# EAGLE design 2nd_layer (EAGLE 9.6.2)
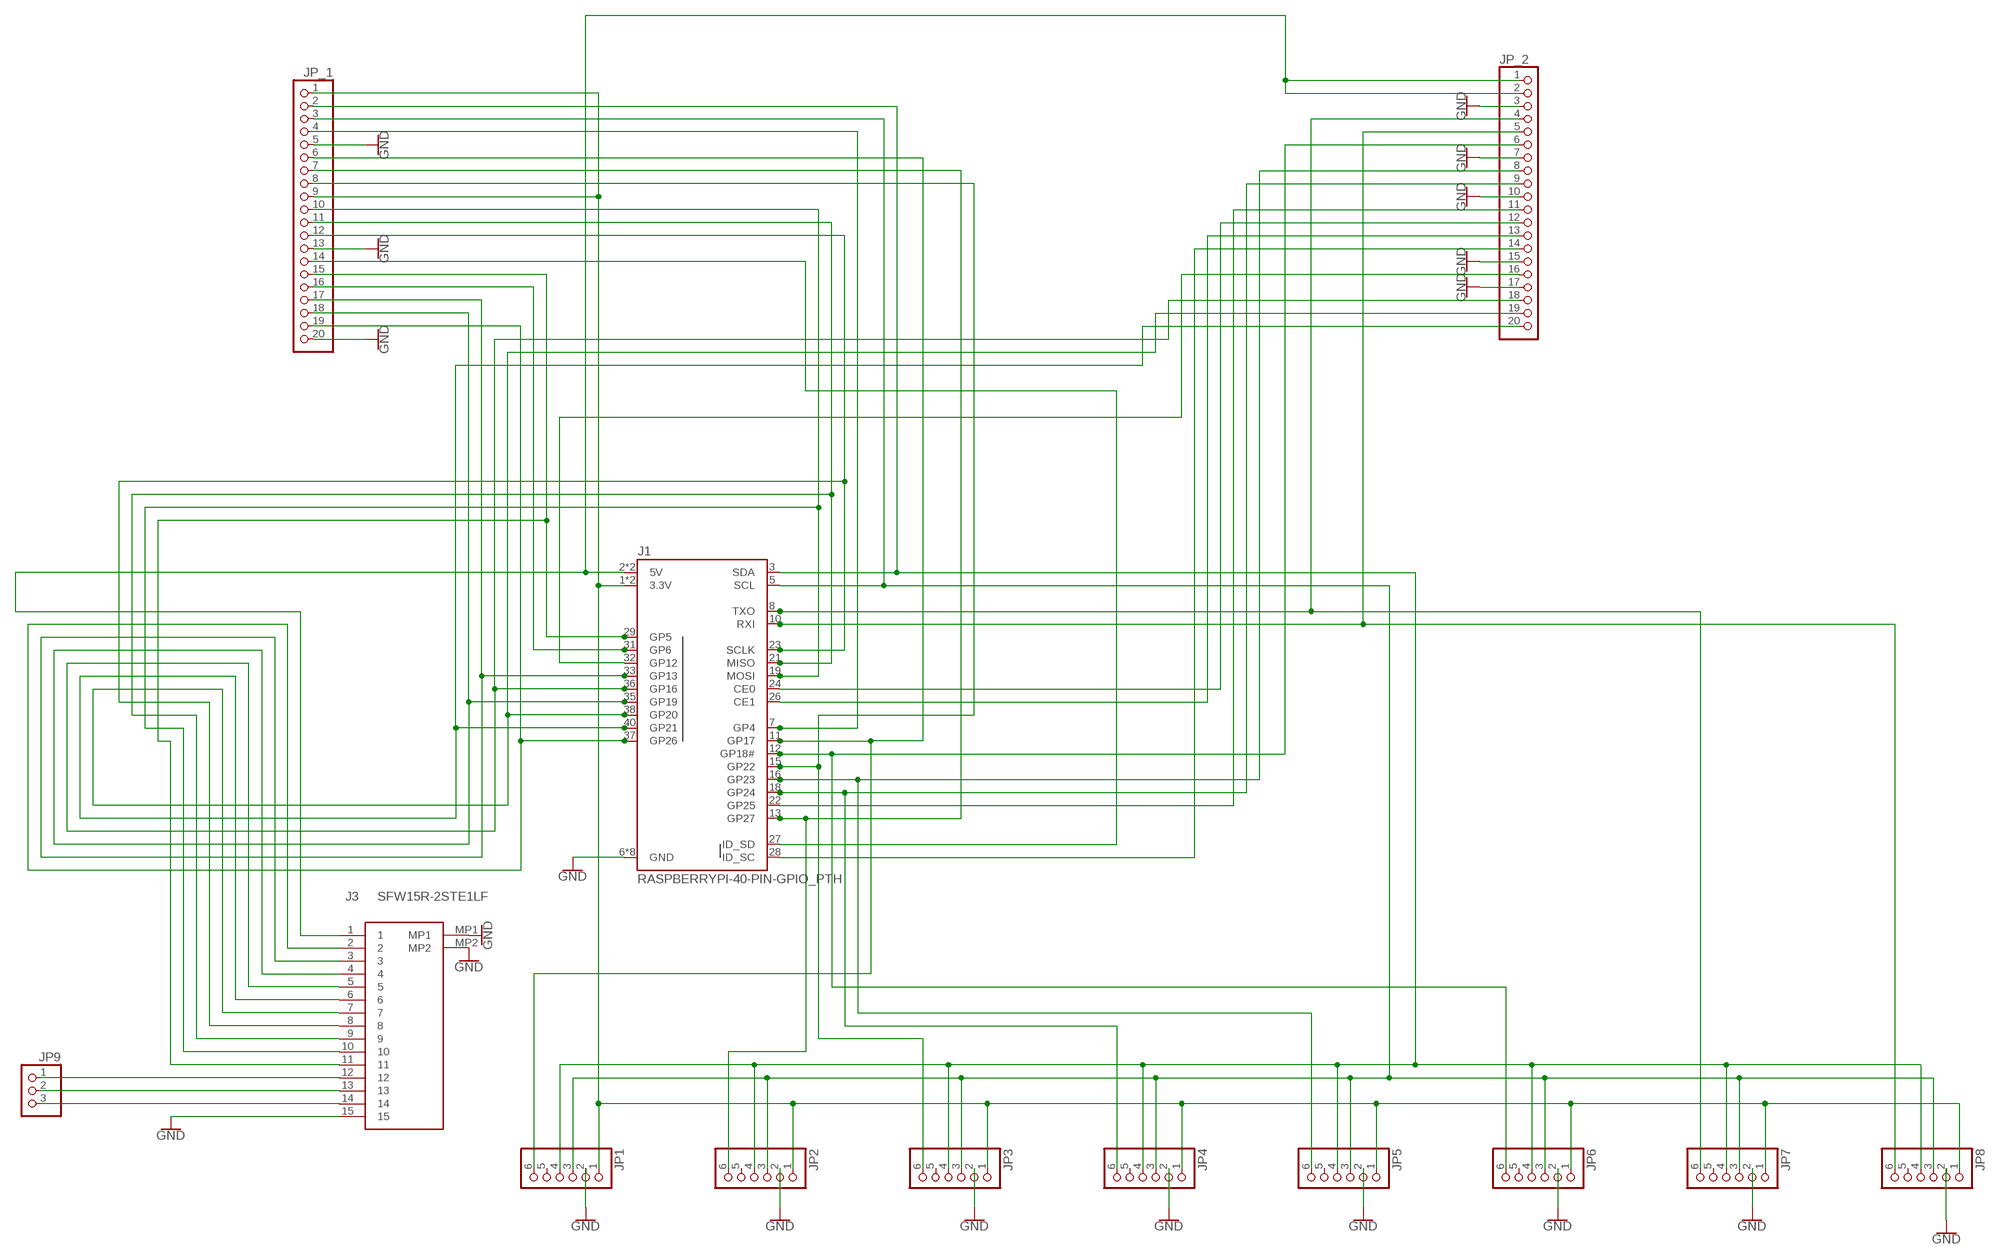
[diagram p0: schematic, sheet 1]

## Parts
J1  RASPBERRYPI-40-PIN-GPIO_PTH  [2X20_SHROUDED]
J3  SFW15R-2STE1LF  [SFW15R2STE1LF]
JP1  PINHD-1X6  [1X06]
JP2  PINHD-1X6  [1X06]
JP3  PINHD-1X6  [1X06]
JP4  PINHD-1X6  [1X06]
JP5  PINHD-1X6  [1X06]
JP6  PINHD-1X6  [1X06]
JP7  PINHD-1X6  [1X06]
JP8  PINHD-1X6  [1X06]
JP9  PINHD-1X3  [1X03]
JP_1  PINHD-1X20  [1X20]
JP_2  PINHD-1X20  [1X20]

## Nets
GND: J1.6(GND) J1.9(GND) J1.14(GND) J1.20(GND) J1.25(GND) J1.30(GND) J1.34(GND) J1.39(GND) J3.15 J3.MP1 J3.MP2 JP1.2 JP2.2 JP3.2 JP4.2 JP5.2 JP6.2 JP7.2 JP8.2 JP_1.5 JP_1.13 JP_1.20 JP_2.3 JP_2.7 JP_2.10 JP_2.15 JP_2.17
N$1: J1.7(GP4) JP_1.4
N$2: J1.31(GP6) JP_1.16
N$3: J1.22(GP25) JP_2.11
N$4: J1.2(5V) J1.4(5V) J3.1 JP_2.1 JP_2.2
N$5: J1.1(3.3V) J1.17(3.3V) JP1.1 JP2.1 JP3.1 JP4.1 JP5.1 JP6.1 JP7.1 JP8.1 JP_1.1 JP_1.9
N$6: J1.27(ID_SD) JP_1.14
N$7: J1.5(SCL) JP1.3 JP2.3 JP3.3 JP4.3 JP5.3 JP6.3 JP7.3 JP8.3 JP_1.3
N$8: J1.3(SDA) JP1.4 JP2.4 JP3.4 JP4.4 JP5.4 JP6.4 JP7.4 JP8.4 JP_1.2
N$9: J1.11(GP17) JP1.6 JP_1.6
N$10: J1.13(GP27) JP2.6 JP_1.7
N$11: J1.15(GP22) JP3.6 JP_1.8
N$12: J1.18(GP24) JP4.6 JP_2.9
N$13: J1.16(GP23) JP5.6 JP_2.8
N$14: J1.12(GP18#) JP6.6 JP_2.6
N$15: J1.8(TXO) JP7.6 JP_2.4
N$16: J1.10(RXI) JP8.6 JP_2.5
N$17: J1.37(GP26) J3.2 JP_1.19
N$18: J1.33(GP13) J3.3 JP_1.17
N$19: J1.35(GP19) J3.4 JP_1.18
N$20: J1.36(GP16) J3.5 JP_2.18
N$21: J1.40(GP21) J3.6 JP_2.20
N$22: J1.38(GP20) J3.7 JP_2.19
N$23: J1.23(SCLK) J3.8 JP_1.12
N$24: J1.21(MISO) J3.9 JP_1.11
N$25: J1.19(MOSI) J3.10 JP_1.10
N$26: J1.29(GP5) J3.11 JP_1.15
N$27: J1.24(CE0) JP_2.12
N$28: J1.26(CE1) JP_2.13
N$29: J1.28(ID_SC) JP_2.14
N$30: J1.32(GP12) JP_2.16
N$31: J3.12 JP9.1
N$32: J3.13 JP9.2
N$33: J3.14 JP9.3
Unconnected: JP1.5 JP2.5 JP3.5 JP4.5 JP5.5 JP6.5 JP7.5 JP8.5

## Library data of the parts
J1 = SparkFun-Connectors:RASPBERRYPI-40-PIN-GPIO: Raspberry Pi GPIO Header 2x20 pin connector, as found on B, B+, A+ models. Both shrouded PTH and SMT versions available. SparkFun Products: GPIO Shrouded Header <https://www.sparkfun.com/products/13054>- PTH SparkFun Pi Wedge (Preassembled) <https://www.sparkfun.com/products/13717>; PROD_ID: CONN-12263; SF_ID: PRT-13054
J3 = SFW15R-2STE1LF:SFW15R-2STE1LF: FFC & FPC Connectors 15P SIDE SMT ZIF UPPER CONTACT Source: Datasheet <https://cdn.amphenol-icc.com/media/wysiwyg/files/drawing/sfw12lf.pdf>; DESCRIPTION: FFC & FPC Connectors 15P SIDE SMT ZIF UPPER CONTACT; HEIGHT: 2.7mm; MANUFACTURER_NAME: Amphenol; MANUFACTURER_PART_NUMBER: SFW15R-2STE1LF
JP1-JP8 = adafruit:PINHD-1X6: PIN HEADER
JP9 = pinhead:PINHD-1X3: PIN HEADER
JP_1 JP_2 = pinhead:PINHD-1X20: PIN HEADER

## Board
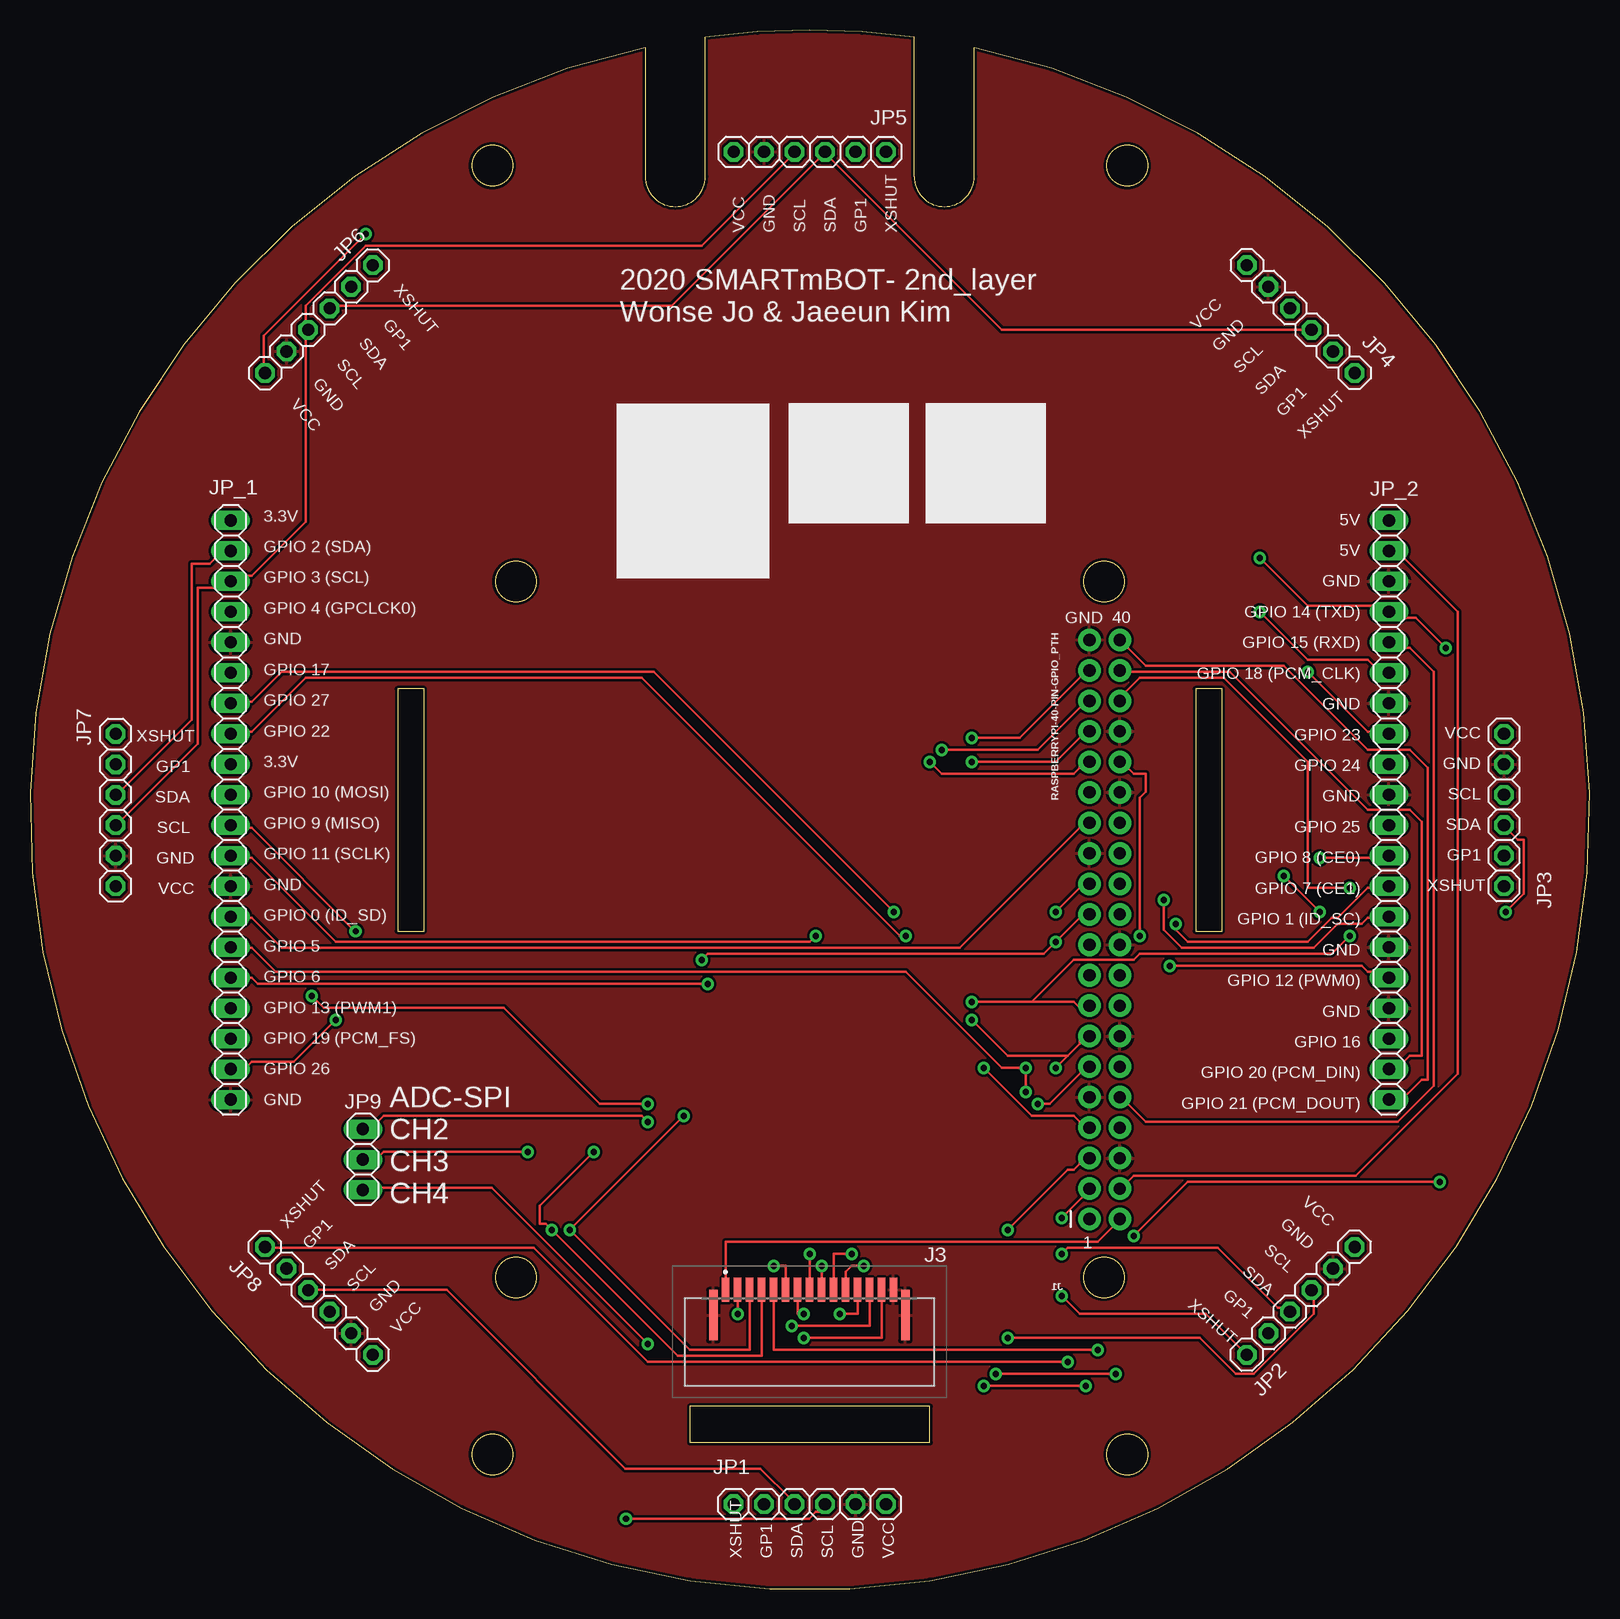
[diagram p1: board, top side]
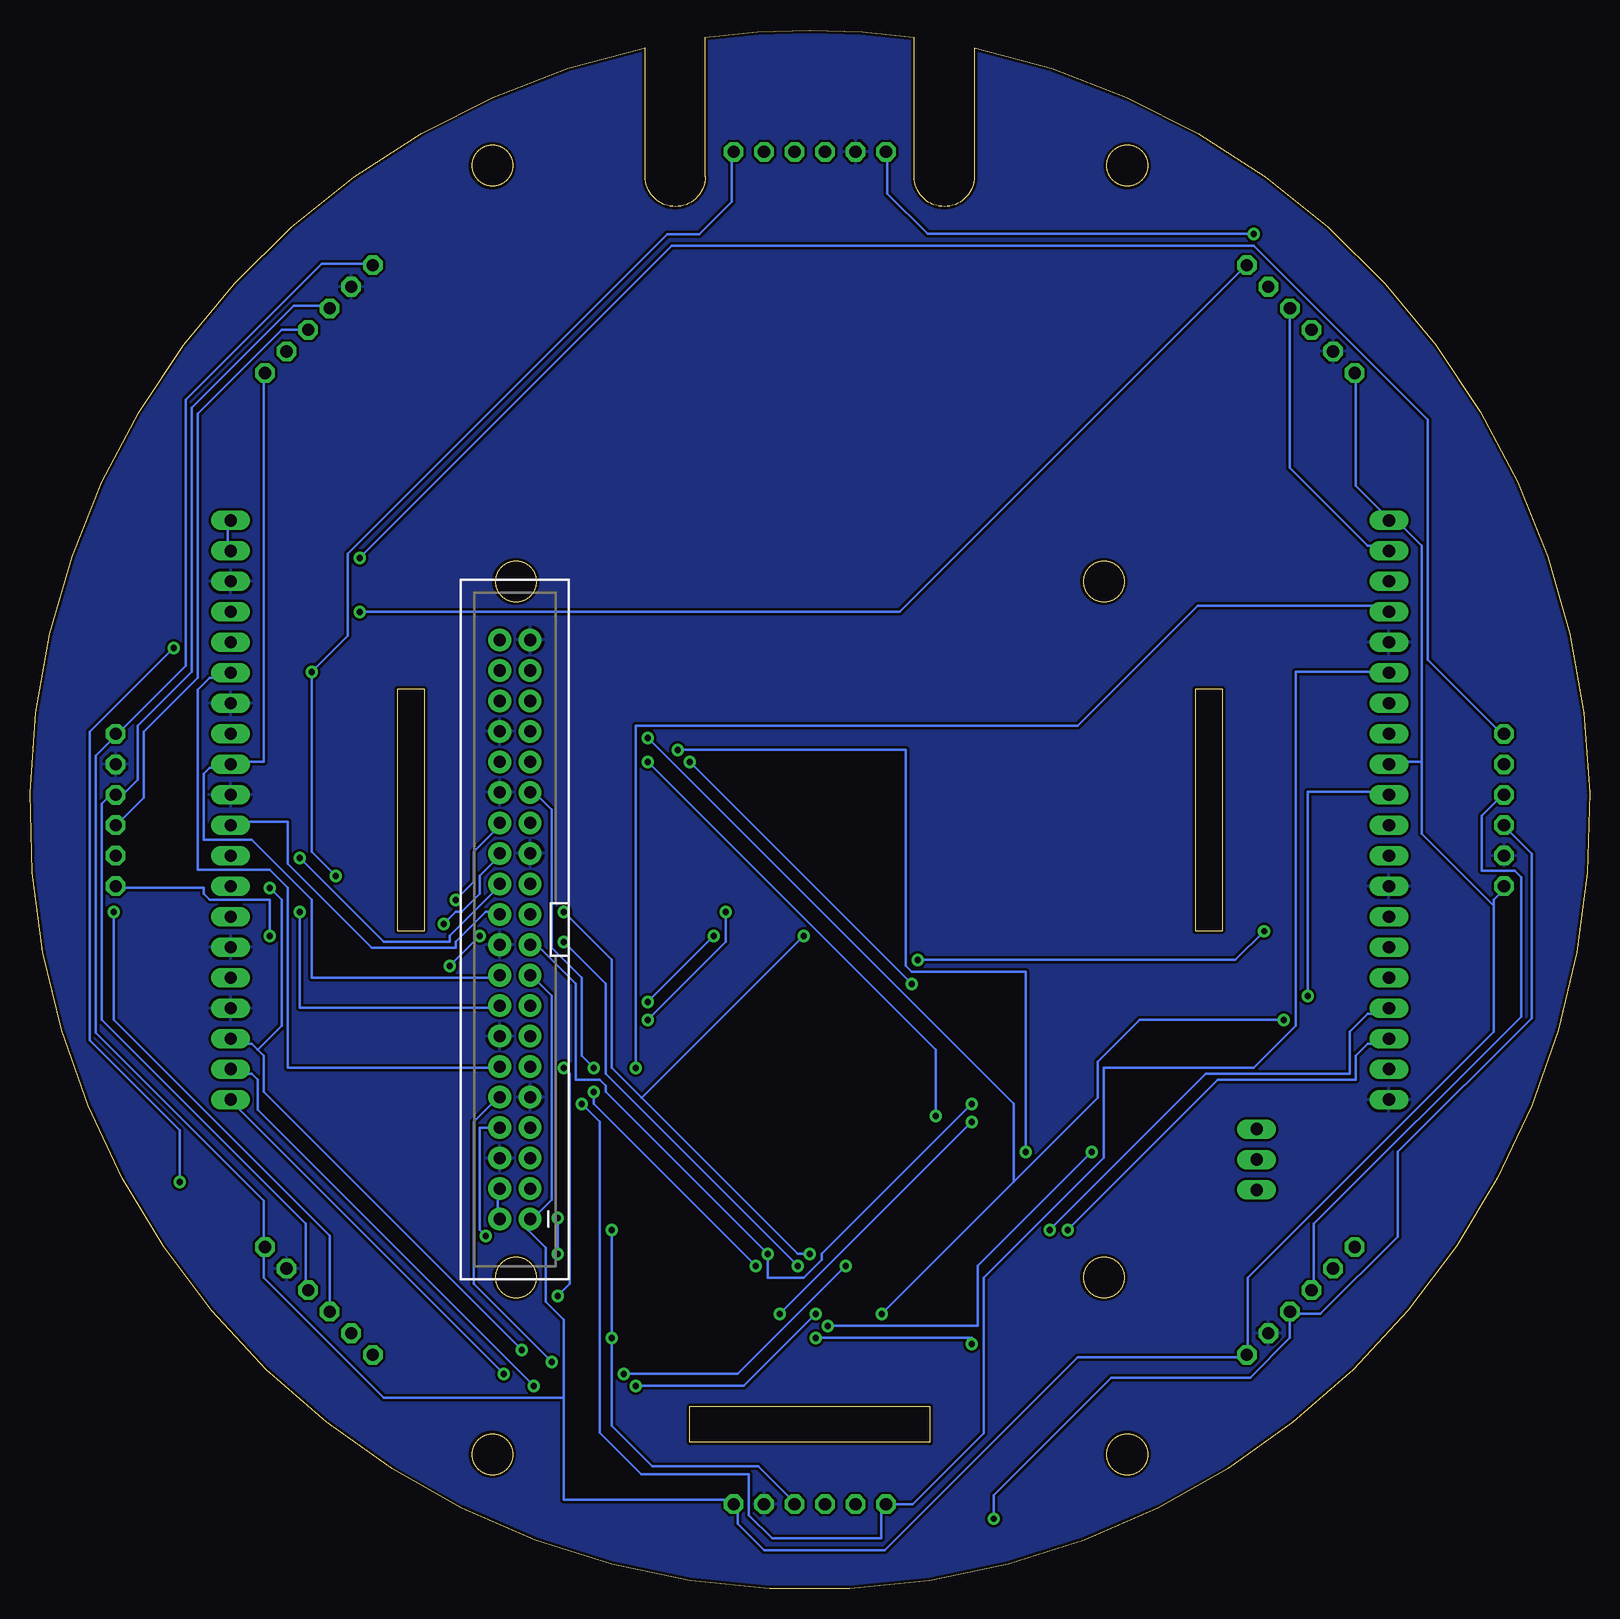
[diagram p2: board, bottom side, seen from below]

Size 129.97 x 129.91 mm. Coordinates in mm from the lower left corner, seen from the top.
Outline: 30.63,54.81 32.83,54.81 32.83,75.01 30.63,75.01 30.63,54.81
Outline: 97.13,54.81 99.33,54.81 99.33,75.01 97.13,75.01 97.13,54.81
Outline: 73.69,117.7 arc90 76.19,115.2 76.19,115.2 arc90 78.69,117.7 78.69,128.45 arc-336 51.28,128.45 51.28,117.7 arc90 53.78,115.2 53.78,115.2 arc90 56.28,117.7 56.28,129.33 arc-15 73.69,129.33 73.69,117.7
Outline: 74.98,12.21 74.98,15.21 54.98,15.21 54.98,12.21 74.98,12.21
Outline: circle at 38.53,118.61 radius 1.7
Outline: circle at 91.43,11.21 radius 1.7
Outline: circle at 38.53,11.21 radius 1.7
Outline: circle at 91.43,118.61 radius 1.7
Outline: circle at 40.48,83.95 radius 1.7
Outline: circle at 89.48,25.95 radius 1.7
Outline: circle at 40.48,25.95 radius 1.7
Outline: circle at 89.48,83.95 radius 1.7
Copper layers (1*16): Top 0.035mm / dielectric 1.5mm / Bottom 0.035mm
Design rules "SparkFun": minimum track width 8mil, minimum drill 20mil, track to track 8mil, track to pad 8mil, pad to pad 8mil, via to via 8mil, smd to smd 8mil, copper to edge 10mil, drill to drill 8mil, minimum pad ring 12mil, minimum via ring 10mil, stop-mask expansion 4mil, vias tented up to drill 25mil, thermal gap 10mil

### Footprints (pad centres in the part's own frame; a part is rotated, then mirrored left to right if it is on the bottom)
2X20_SHROUDED = drill 1.016 pad 1.88: 1 -1.27,24.13; 2 1.27,24.13; 3 -1.27,21.59; 4 1.27,21.59; 5 -1.27,19.05; 6 1.27,19.05; 7 -1.27,16.51; 8 1.27,16.51; 9 -1.27,13.97; 10 1.27,13.97; 11 -1.27,11.43; 12 1.27,11.43; 13 -1.27,8.89; 14 1.27,8.89; 15 -1.27,6.35; 16 1.27,6.35; 17 -1.27,3.81; 18 1.27,3.81; 19 -1.27,1.27; 20 1.27,1.27; 21 -1.27,-1.27; 22 1.27,-1.27; 23 -1.27,-3.81; 24 1.27,-3.81; 25 -1.27,-6.35; 26 1.27,-6.35; 27 -1.27,-8.89; 28 1.27,-8.89; 29 -1.27,-11.43; 30 1.27,-11.43; 31 -1.27,-13.97; 32 1.27,-13.97; 33 -1.27,-16.51; 34 1.27,-16.51; 35 -1.27,-19.05; 36 1.27,-19.05; 37 -1.27,-21.59; 38 1.27,-21.59; 39 -1.27,-24.13; 40 1.27,-24.13
SFW15R2STE1LF = smd 0.6 x 2: 1 -7,4; 2 -6,4; 3 -5,4; 4 -4,4; 5 -3,4; 6 -2,4; 7 -1,4; 8 0,4; 9 1,4; 10 2,4; 11 3,4; 12 4,4; 13 5,4; 14 6,4; 15 7,4 | smd 0.7 x 4.2: MP1 -8,1.9; MP2 8,1.9
1X06 = drill 1.016 octagon: 1 -6.35,0; 2 -3.81,0; 3 -1.27,0; 4 1.27,0; 5 3.81,0; 6 6.35,0
1X03 = drill 1.016 long: 1 -2.54,0; 2 0,0; 3 2.54,0
1X20 = drill 1.016 long: 1 -24.13,0; 2 -21.59,0; 3 -19.05,0; 4 -16.51,0; 5 -13.97,0; 6 -11.43,0; 7 -8.89,0; 8 -6.35,0; 9 -3.81,0; 10 -1.27,0; 11 1.27,0; 12 3.81,0; 13 6.35,0; 14 8.89,0; 15 11.43,0; 16 13.97,0; 17 16.51,0; 18 19.05,0; 19 21.59,0; 20 24.13,0

### Placement (x,y rotation side)
J1  89.55,54.95 180 bottom
J3  64.95,20.91 0 top
JP1  64.98,7.06 180 top
JP2  105.89,24 225 top
JP3  122.83,64.91 270 top
JP4  105.89,105.82 315 top
JP5  64.98,119.76 0 top
JP6  24.07,105.82 45 top
JP7  7.13,64.91 90 top
JP8  24.07,24 135 top
JP9  27.74,35.79 270 top
JP_1  16.72,64.91 270 top
JP_2  113.24,64.91 270 top

### Tracks (layer width: path | path; a pad name or v marks a point on that pad's centre or on a via)
GND
  pour Top: 53.78,115.2 arc-90 51.28,117.7 51.28,128.45 arc336 78.69,128.45 78.69,117.7 arc-90 76.19,115.2 76.19,115.2 arc-90 73.69,117.7 73.69,129.33 arc15 56.28,129.33 56.28,117.7 arc-90 53.78,115.2
  pour Top: 51.28,128.45 51.28,117.7 arc90 53.78,115.2 53.78,115.2 arc90 56.28,117.7 56.28,129.33 arc-15 73.69,129.33 73.69,117.7 arc90 76.19,115.2 76.19,115.2 arc90 78.69,117.7 78.69,128.45 arc-336
  pour Bottom: 51.28,128.45 51.28,117.7 arc90 53.78,115.2 53.78,115.2 arc90 56.28,117.7 56.28,129.33 arc-15 73.69,129.33 73.69,117.7 arc90 76.19,115.2 76.19,115.2 arc90 78.69,117.7 78.69,128.45 arc-336
N$1  (via drill 0.51)
  Top 0.203: v79.48,43.41 83.48,39.41 86.98,39.41 87.48,38.91 87.48,38.41 87.98,38.41 J1.7
  Bottom 0.203: v79.48,43.41 79.48,71.91 42.65,71.91 32.65,81.91 16.98,81.91 JP_1.4
N$2  (via drill 0.51)
  Top 0.203: v56.48,50.41 18.98,50.41 18.48,50.91 16.98,50.91 JP_1.16 | v74.98,68.91 75.98,67.91 86.98,67.91 87.48,68.41 87.48,68.91 87.98,68.91 J1.31
  Bottom 0.203: v74.98,68.91 v56.48,50.41
N$3
  Bottom 0.203: JP_2.11 112.98,63.91 108.48,63.91 108.48,60.41 101.48,53.41 94.48,53.41 94.48,53.91 91.98,56.41 90.98,56.41 J1.22
N$4
  Top 0.203: J3.1 57.98,24.91 57.98,28.91 88.98,28.91 90.48,30.41 J1.2 | JP_2.2 113.48,86.41 113.98,85.91 114.48,85.91 118.98,81.41 118.98,42.91 110.48,34.41 91.98,34.41 90.98,33.41 J1.4
  Bottom 0.203: JP_2.2 113.48,86.91 113.48,88.91 JP_2.1 | J1.4 90.98,32.91 90.98,30.91 J1.2
N$5  (via drill 0.51)
  Top 0.203: v27.98,112.91 19.48,104.41 19.48,101.41 JP6.1
  Bottom 0.203: 7.98,56.91 7.98,57.41 7.48,57.91 7.48,58.41 JP7.1 | 7.98,56.91 7.98,46.41 28.48,25.91 28.48,19.91 JP8.1 28.98,19.41 29.1,19.3 42.63,19.3 58.72,3.22 68.79,3.22 70.98,5.41 70.98,6.91 JP1.1 71.48,7.41 85.48,7.41 85.48,15.91 | 13.98,68.91 16.48,68.91 JP_1.9 | 13.98,68.91 13.98,62.91 7.98,56.91 | JP6.1 19.48,100.91 19.48,91.91 16.98,89.41 JP_1.1 16.48,89.41 13.98,86.91 13.98,68.91 | v27.98,112.91 55.17,112.91 58.54,116.28 58.54,119.55 JP5.1 | 85.48,15.91 85.48,22.41 86.98,23.91 86.98,28.41 88.48,29.91 88.48,30.41 J1.1 87.98,30.91 86.48,32.41 86.48,49.41 87.98,50.91 J1.17 | 110.48,28.41 110.48,25.91 100.48,15.91 85.48,15.91 | 110.48,28.41 110.48,32.35 124.48,46.35 124.48,69.41 122.98,70.91 JP3.1 122.48,71.41 116.98,76.91 116.98,99.09 105.66,110.41 101.48,110.41 JP4.1 | 110.48,28.41 JP2.1
N$6
  Top 0.203: JP_1.14 16.98,55.91 18.48,55.91 20.98,53.41 77.48,53.41 87.48,63.41 87.48,63.91 87.98,63.91 J1.27
N$7  (via drill 0.51)
  Top 0.203: JP5.3 63.48,119.41 55.98,111.91 27.98,111.91 22.98,106.91 22.98,105.41 JP6.3 22.98,104.91 22.98,88.91 18.48,84.41 16.98,84.41 JP_1.3 16.48,83.91 15.98,83.41 13.98,83.41 13.98,70.41 7.48,63.91 JP7.3 | v81.48,29.91 86.48,34.91 86.98,34.91 87.48,35.41 87.48,35.91 87.98,35.91 J1.5 | v81.48,20.91 97.48,20.91 100.48,17.91 101.98,17.91 106.98,22.91 106.98,24.41 JP2.3 | v49.66,5.85 64.92,5.85 65.48,6.41 65.98,6.41 66.48,6.91 JP1.3
  Bottom 0.203: JP7.3 6.98,63.41 4.84,61.27 4.84,47.56 15.98,36.41 15.98,29.36 22.43,22.91 24.48,22.91 JP8.3 24.98,22.91 24.98,20.91 28.29,17.61 39.88,17.61 49.66,7.83 v49.66,5.85 | v81.48,29.91 v81.48,20.91 81.48,13.6 78.11,10.22 69.29,10.22 66.48,7.41 JP1.3 | JP2.3 106.98,24.91 106.98,30.41 123.98,47.41 123.98,65.41 122.98,66.41 JP3.3 122.48,65.91 120.98,67.41 120.98,71.91 116.48,76.41 116.48,98.41 107.98,106.91 105.48,106.91 JP4.3
N$8  (via drill 0.51)
  Top 0.203: JP4.4 106.48,104.91 80.98,104.91 66.48,119.41 JP5.4 65.98,119.41 53.48,106.91 24.98,106.91 JP6.4 | v122.98,56.41 124.48,57.91 124.48,62.41 123.98,62.41 122.98,63.41 JP3.4 | v85.98,30.91 87.98,32.91 J1.3 | v85.98,27.91 86.48,28.41 98.98,28.41 103.98,23.41 104.98,23.41 JP2.4 | JP7.4 7.48,66.41 13.48,72.41 13.48,85.41 14.98,85.41 15.98,86.41 16.48,86.41 JP_1.2 | JP1.4 63.48,7.41 60.87,10.03 49.6,10.03 34.72,24.91 23.48,24.91 JP8.4
  Bottom 0.203: v122.98,56.41 122.98,47.41 104.98,29.41 104.98,23.41 JP2.4 | v85.98,27.91 v85.98,30.91 | JP4.4 106.98,104.91 108.98,104.91 115.98,97.91 115.98,75.91 120.48,71.41 120.48,65.91 122.48,63.91 JP3.4 | JP8.4 22.98,24.91 22.98,30.41 5.69,47.71 5.69,59.31 6.22,59.83 8.98,59.83 8.98,64.41 7.48,65.91 JP7.4 | JP6.4 24.98,106.41 24.98,93.41 18.48,86.91 16.98,86.91 JP_1.2
N$9  (via drill 0.51)
  Top 0.203: v83.98,40.41 84.98,40.41 87.98,43.41 J1.11
  Bottom 0.203: JP_1.6 16.98,76.41 24.48,76.41 24.48,46.91 27.98,43.41 40.48,43.41 40.48,35.91 50.48,25.91 50.48,13 56.41,7.06 JP1.6 58.98,6.91 58.98,6.41 59.03,6.37 59.03,4.22 68.13,4.22 70.05,6.15 70.05,9.55 79.01,9.55 82.48,13.02 82.48,38.91 v83.98,40.41
N$10  (via drill 0.51)
  Top 0.203: v85.98,24.41 87.48,22.91 97.98,22.91 100.98,19.91 JP2.6 | 86.48,44.41 87.48,45.41 87.48,45.91 87.98,45.91 J1.13 | 86.48,44.41 v85.48,43.41 | v71.98,56.41 51.98,76.41 20.98,76.41 18.48,73.91 16.98,73.91 JP_1.7 | v78.48,47.41 81.48,44.41 86.48,44.41
  Bottom 0.203: v85.98,24.41 84.98,25.41 84.98,42.91 v85.48,43.41 | v71.98,56.41 71.98,53.91 v78.48,47.41
N$11  (via drill 0.51)
  Top 0.203: v72.98,54.41 72.48,54.41 50.98,75.91 22.98,75.91 18.48,71.41 16.98,71.41 JP_1.8 | 83.48,48.91 86.98,48.91 87.48,48.41 87.98,48.41 J1.15 | 83.48,48.91 v78.48,48.91 | v109.98,54.41 108.48,52.91 92.48,52.91 91.98,52.41 86.98,52.41 83.48,48.91
  Bottom 0.203: v78.48,48.91 v72.98,54.41 | v109.98,54.41 109.98,57.41 114.98,57.41 115.48,57.91 115.48,58.41 122.48,58.41 JP3.6
N$12
  Bottom 0.203: JP4.6 110.48,100.91 110.48,68.91 112.98,68.91 JP_2.9 113.48,68.41 114.98,68.41 115.48,67.91 115.48,62.41 111.48,62.41 106.48,57.41 106.48,50.91 90.98,50.91 J1.18
N$13  (via drill 0.51)
  Top 0.203: v106.48,76.41 111.48,71.41 112.98,71.41 JP_2.8 | v104.48,59.41 v107.48,56.41
  Bottom 0.203: JP5.6 71.48,119.41 71.48,115.6 74.19,112.89 76.85,112.89 103.48,86.26 103.48,79.41 v106.48,76.41 106.48,61.41 v104.48,59.41 | v107.48,56.41 107.48,48.41 90.98,48.41 J1.16
N$14  (via drill 0.51)
  Top 0.203: v102.48,81.41 106.48,77.41 111.48,77.41 112.48,76.41 112.98,76.41 JP_2.6
  Bottom 0.203: v102.48,81.41 57.48,81.41 28.98,109.91 JP6.6 | J1.12 90.98,43.41 108.48,43.41 108.48,58.41 109.98,59.91 115.98,59.91 115.98,74.91 114.98,75.91 113.48,75.91 JP_2.6
N$15  (via drill 0.51)
  Top 0.203: v102.48,85.91 106.48,81.91 112.98,81.91 JP_2.4 113.48,81.41 113.98,80.91 115.48,80.91 v117.98,78.41 | v91.98,29.41 96.48,33.91 v117.48,33.91
  Bottom 0.203: v102.48,85.91 76.48,111.91 27.98,111.91 13.48,97.41 13.48,77.41 7.48,71.41 JP7.6 | v91.98,29.41 92.48,29.91 92.48,38.41 90.98,38.41 J1.8 | v117.48,33.91 117.48,38.22 124.98,45.72 124.98,71.41 v117.98,78.41
N$16  (via drill 0.51)
  Top 0.203: v86.48,18.91 51.48,18.91 41.98,28.41 19.98,28.41 JP8.6 | JP_2.5 113.48,78.41 114.98,78.41 116.98,76.41 116.98,41.91 113.98,38.91 92.98,38.91 90.98,40.91 J1.10
  Bottom 0.203: v86.48,18.91 92.98,25.41 92.98,38.91 90.98,40.91 J1.10
N$17  (via drill 0.51)
  Top 0.203: v58.98,22.91 58.98,24.91 J3.2 | v25.48,47.41 21.98,43.91 18.48,43.91 17.98,43.41 16.98,43.41 JP_1.19 | v78.48,70.91 82.48,70.91 87.98,76.41 J1.37
  Bottom 0.203: 47.98,33.91 40.98,40.91 40.98,43.91 37.48,47.41 v25.48,47.41 | 47.98,33.91 v58.98,22.91 | v78.48,70.91 47.98,40.41 47.98,33.91
N$18  (via drill 0.51)
  Top 0.203: J3.3 59.98,24.91 59.98,19.91 54.98,19.91 v44.98,29.91 v54.48,39.41 | v78.48,68.91 85.48,68.91 87.98,71.41 J1.33
  Bottom 0.203: v44.98,29.91 31.98,42.91 19.98,42.91 19.98,46.41 18.48,47.91 16.98,47.91 JP_1.17 | v78.48,68.91 54.48,44.91 v54.48,39.41
N$19  (via drill 0.51)
  Top 0.203: J3.4 60.98,24.91 60.98,19.41 53.98,19.41 v43.48,29.91 42.98,30.41 42.48,30.41 42.48,31.91 v46.98,36.41 | v75.98,69.91 83.98,69.91 87.98,73.91 J1.35
  Bottom 0.203: v43.48,29.91 30.98,42.41 19.48,42.41 19.48,44.41 18.48,45.41 16.98,45.41 JP_1.18 | v75.98,69.91 56.98,69.91 56.98,51.91 56.48,51.41 46.98,51.41 v46.98,36.41
N$20  (via drill 0.51)
  Top 0.203: v88.98,19.91 61.98,19.91 61.98,24.91 J3.5 | v109.98,58.41 106.48,58.41 106.48,68.91 99.48,75.91 92.48,75.91 90.98,74.41 J1.36
  Bottom 0.203: v88.98,19.91 110.48,41.41 110.48,44.41 110.98,44.91 | 110.98,44.91 111.48,45.41 112.98,45.41 JP_2.18 | v109.98,58.41 108.98,57.41 108.98,46.91 110.98,44.91
N$21  (via drill 0.51)
  Top 0.203: v61.98,26.91 62.98,26.91 62.98,24.91 J3.6 | v90.48,17.91 v80.48,17.91 | J1.40 90.98,78.91 92.98,76.91 104.48,76.91 111.48,69.91 114.98,69.91 116.48,68.41 116.48,42.41 115.98,42.41 114.48,40.91 113.48,40.91 JP_2.20
  Bottom 0.203: v61.98,26.91 70.98,17.91 v80.48,17.91 | v90.48,17.91 112.98,40.41 JP_2.20
N$22  (via drill 0.51)
  Top 0.203: v64.48,22.91 63.98,22.91 63.98,24.91 J3.7 | v87.98,16.91 v79.48,16.91 | J1.38 90.98,76.41 99.98,76.41 111.48,64.91 114.98,64.91 115.98,63.91 115.98,44.41 114.98,44.41 113.98,43.41 113.48,43.41 JP_2.19
  Bottom 0.203: v64.48,22.91 70.48,16.91 v79.48,16.91 | v87.98,16.91 110.98,39.91 110.98,42.41 111.48,42.91 112.98,42.91 JP_2.19
N$23  (via drill 0.51)
  Top 0.203: v64.98,27.91 64.98,24.91 J3.8 | v85.48,56.41 87.48,58.41 87.98,58.41 J1.23 | v65.48,54.41 64.98,53.91 25.48,53.91 18.48,60.91 16.98,60.91 JP_1.12
  Bottom 0.203: v64.98,27.91 65.98,27.91 78.98,40.91 | 78.98,40.91 81.48,43.41 81.48,52.41 v85.48,56.41 | 78.98,40.91 v65.48,54.41
N$24  (via drill 0.51)
  Top 0.203: v65.98,26.91 65.98,24.91 J3.9 | J1.21 87.98,55.91 87.48,55.91 v85.48,53.91 84.48,52.91 56.48,52.91 v55.98,52.41 | v27.13,54.82 27.08,54.82 18.48,63.41 16.98,63.41 JP_1.11
  Bottom 0.203: v65.98,26.91 81.98,42.91 81.98,50.41 v85.48,53.91 | v27.13,54.82 29.53,52.41 v55.98,52.41
N$25  (via drill 0.51)
  Top 0.203: v68.48,27.91 66.98,27.91 66.98,24.91 J3.10 | v23.48,49.41 24.48,48.41 39.48,48.41 47.48,40.41 v51.48,40.41
  Bottom 0.203: J1.19 87.98,53.91 84.48,50.41 84.48,42.41 82.48,42.41 81.98,41.91 81.98,41.41 v68.48,27.91 68.48,25.91 65.48,25.91 63.98,27.41 63.98,27.91 v51.48,40.41 | v23.48,49.41 23.48,66.41 16.98,66.41 JP_1.10
N$26  (via drill 0.51)
  Top 0.203: v69.48,26.91 68.48,26.91 67.98,26.41 67.98,24.91 J3.11 | v82.98,41.41 v82.98,43.41 80.98,43.41 72.98,51.41 20.48,51.41 18.48,53.41 16.98,53.41 JP_1.15
  Bottom 0.203: v69.48,26.91 82.98,40.41 v82.98,41.41 | v82.98,43.41 83.98,44.41 83.98,50.91 86.48,53.41 86.48,64.91 87.98,66.41 J1.29
N$27  (via drill 0.51)
  Top 0.203: v107.48,60.91 112.98,60.91 JP_2.12
  Bottom 0.203: v107.48,60.91 100.48,53.91 94.98,53.91 94.98,54.41 90.98,58.41 J1.24
N$28  (via drill 0.51)
  Top 0.203: v95.48,55.41 95.48,54.91 96.48,53.91 106.48,53.91 108.48,55.91 108.98,55.91 111.48,58.41 112.98,58.41 JP_2.13
  Bottom 0.203: v95.48,55.41 94.48,56.41 93.98,56.41 92.48,57.91 92.48,59.41 90.98,60.91 J1.26
N$29  (via drill 0.51)
  Top 0.203: v94.48,57.41 94.48,54.91 95.98,53.41 106.98,53.41 108.98,55.41 110.98,55.41 111.48,55.91 112.98,55.91 JP_2.14
  Bottom 0.203: v94.48,57.41 92.98,58.91 92.98,61.41 90.98,63.41 J1.28
N$30  (via drill 0.51)
  Top 0.203: v94.98,51.91 110.98,51.91 111.48,51.41 112.98,51.41 JP_2.16 | v92.48,54.41 92.48,65.91 92.98,66.41 92.98,67.91 91.98,67.91 90.98,68.91 J1.32
  Bottom 0.203: v92.48,54.41 v94.98,51.91
N$31  (via drill 0.51)
  Top 0.203: v67.48,22.91 68.98,22.91 68.98,24.91 J3.12 | v51.48,38.91 50.98,39.41 29.48,39.41 28.48,38.41 27.98,38.41 JP9.1
  Bottom 0.203: v51.48,38.91 v67.48,22.91
N$32  (via drill 0.51)
  Top 0.203: v63.48,21.91 69.98,21.91 69.98,24.91 J3.13 | v41.48,36.41 29.48,36.41 28.98,35.91 27.98,35.91 JP9.2
  Bottom 0.203: v63.48,21.91 50.98,21.91 50.98,26.91 v41.48,36.41
N$33  (via drill 0.51)
  Top 0.203: v64.48,20.91 70.98,20.91 70.98,24.91 J3.14 | v51.48,20.41 38.48,33.41 27.98,33.41 JP9.3
  Bottom 0.203: v64.48,20.91 51.48,20.91 v51.48,20.41

### Text on the board
tPlace: VCC / GND / SCL / SDA / GP1 / XSHUT | 2020 SMARTmBOT- 2nd_layer / Wonse Jo & Jaeeun Kim | XSHUT / GP1 / SDA / SCL / GND / VCC | VCC / GND / SCL / SDA / GP1 / XSHUT | GND | 40 | XSHUT / GP1 / SDA / SCL / GND / VCC | VCC / GND / SCL / SDA / GP1 / XSHUT | 3.3V / GPIO 2 (SDA) / GPIO 3 (SCL) / GPIO 4 (GPCLCK0) / GND / GPIO 17 / GPIO 27 / GPIO 22 / 3.3V / GPIO 10 (MOSI) / GPIO 9 (MISO) / GPIO 11 (SCLK) / GND / GPIO 0 (ID_SD) / GPIO 5 / GPIO 6 / GPIO 13 (PWM1) / GPIO 19 (PCM_FS) / GPIO 26 / GND | 5V / 5V / GND / GPIO 14 (TXD) / GPIO 15 (RXD) / GPIO 18 (PCM_CLK) / GND / GPIO 23 / GPIO 24 / GND / GPIO 25 / GPIO 8 (CE0) / GPIO 7 (CE1) / GPIO 1 (ID_SC) / GND / GPIO 12 (PWM0) / GND / GPIO 16 / GPIO 20 (PCM_DIN) / GPIO 21 (PCM_DOUT) | ADC-SPI / CH2 / CH3 / CH4 | VCC / GND / SCL / SDA / GP1 / XSHUT | 1 | XSHUT / GP1 / SDA / SCL / GND / VCC | XSHUT / GP1 / SDA / SCL / GND / VCC